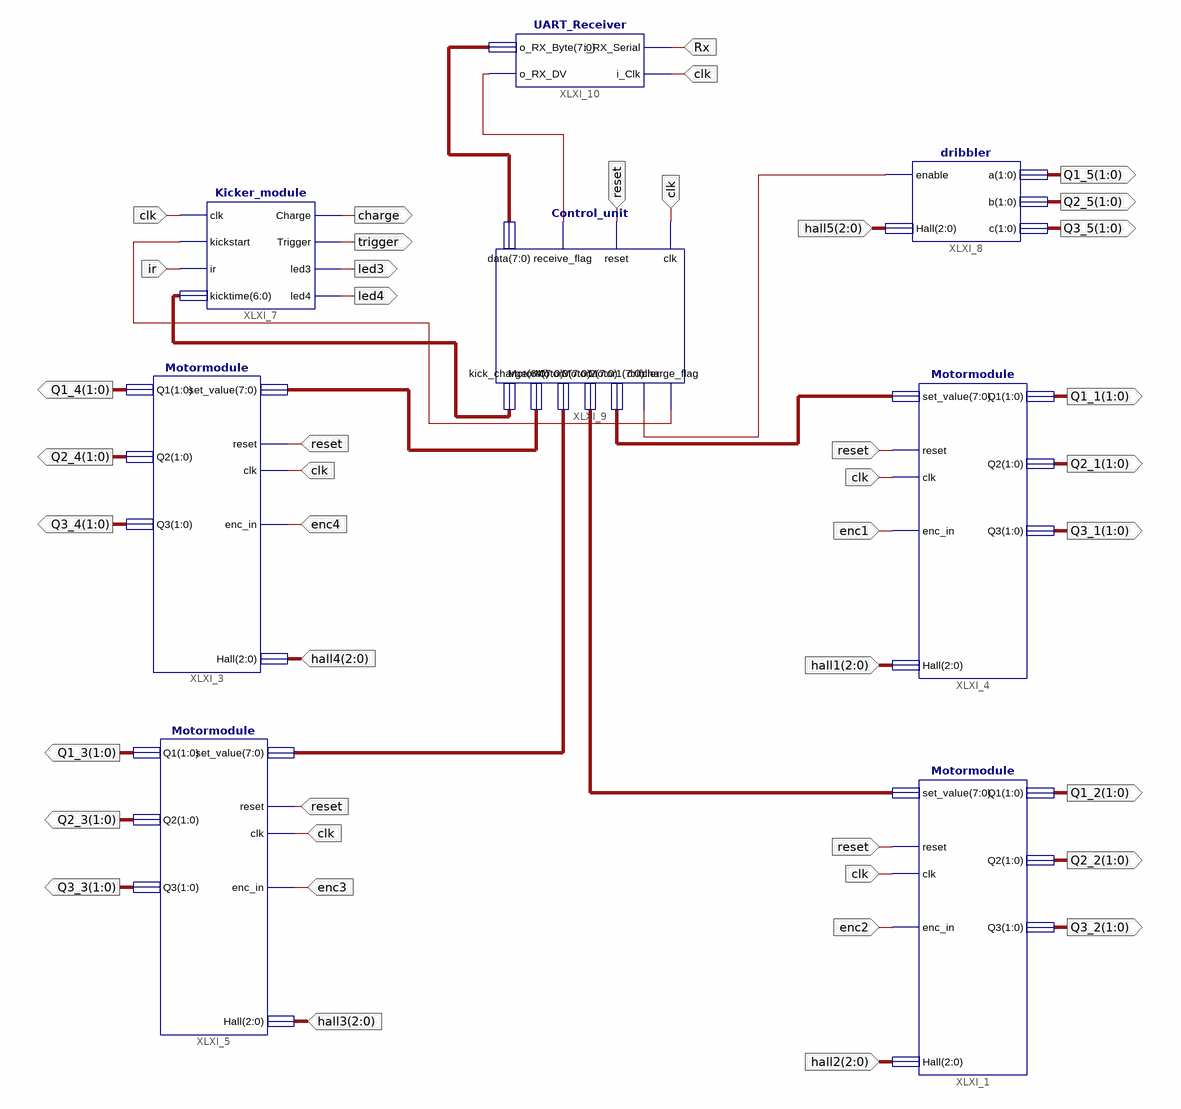
[diagram p0: schematic sheet 1]
// Xilinx ISE schematic Main_module.sch (spartan6) as structural Verilog: 8 symbols, 32 ports
module Main_module (
  input  enc4,
  input  [2:0] hall4,
  input  enc3,
  input  [2:0] hall3,
  input  [2:0] hall2,
  input  enc2,
  input  [2:0] hall1,
  input  enc1,
  input  ir,
  input  clk,
  input  [2:0] hall5,
  input  reset,
  input  Rx,
  output [1:0] Q1_4,
  output [1:0] Q2_4,
  output [1:0] Q3_4,
  output [1:0] Q1_3,
  output [1:0] Q2_3,
  output [1:0] Q3_3,
  output [1:0] Q1_1,
  output [1:0] Q2_1,
  output [1:0] Q3_1,
  output [1:0] Q1_2,
  output [1:0] Q2_2,
  output [1:0] Q3_2,
  output charge,
  output trigger,
  output led3,
  output led4,
  output [1:0] Q3_5,
  output [1:0] Q2_5,
  output [1:0] Q1_5
);

  wire XLXN_88, XLXN_94, XLXN_98;
  wire [6:0] XLXN_89;
  wire [7:0] XLXN_2, XLXN_4, XLXN_64, XLXN_66, XLXN_93;

  Motormodule XLXI_1 (
    .set_value(XLXN_4), .reset(reset), .clk(clk), .enc_in(enc2), .Q1(Q1_2), .Q2(Q2_2), .Q3(Q3_2), .Hall(hall2));
  Motormodule XLXI_3 (
    .set_value(XLXN_64), .reset(reset), .clk(clk), .enc_in(enc4), .Q1(Q1_4), .Q2(Q2_4), .Q3(Q3_4),
    .Hall(hall4));
  Motormodule XLXI_4 (
    .set_value(XLXN_66), .reset(reset), .clk(clk), .enc_in(enc1), .Q1(Q1_1), .Q2(Q2_1), .Q3(Q3_1),
    .Hall(hall1));
  Motormodule XLXI_5 (
    .set_value(XLXN_2), .reset(reset), .clk(clk), .enc_in(enc3), .Q1(Q1_3), .Q2(Q2_3), .Q3(Q3_3), .Hall(hall3));
  Kicker_module XLXI_7 (
    .clk(clk), .kickstart(XLXN_88), .ir(ir), .kicktime(XLXN_89), .Charge(charge), .Trigger(trigger),
    .led3(led3), .led4(led4));
  dribbler XLXI_8 (.enable(XLXN_98), .Hall(hall5), .a(Q1_5), .b(Q2_5), .c(Q3_5));
  Control_unit XLXI_9 (
    .clk(clk), .reset(reset), .receive_flag(XLXN_94), .data(XLXN_93), .charge_flag(XLXN_88),
    .dribller(XLXN_98), .Motor1(XLXN_66), .Motor2(XLXN_4), .Motor3(XLXN_2), .Motor4(XLXN_64),
    .kick_charge(XLXN_89));
  UART_Receiver XLXI_10 (.i_Clk(clk), .i_RX_Serial(Rx), .o_RX_DV(XLXN_94), .o_RX_Byte(XLXN_93));
endmodule
